# Altium schematic sheet XBEE_BREAKOUT.SchDoc: SPEXTRO - XBEE BREAKOUT
size A4; Author: Derek Belsky; Organization: RIT/SPEX; Address1: Rochester Institute of Technology; Address2: Rochester; Address3: New York; Address4: USA; Revision: 0; SheetNumber: 1; SheetTotal: 1
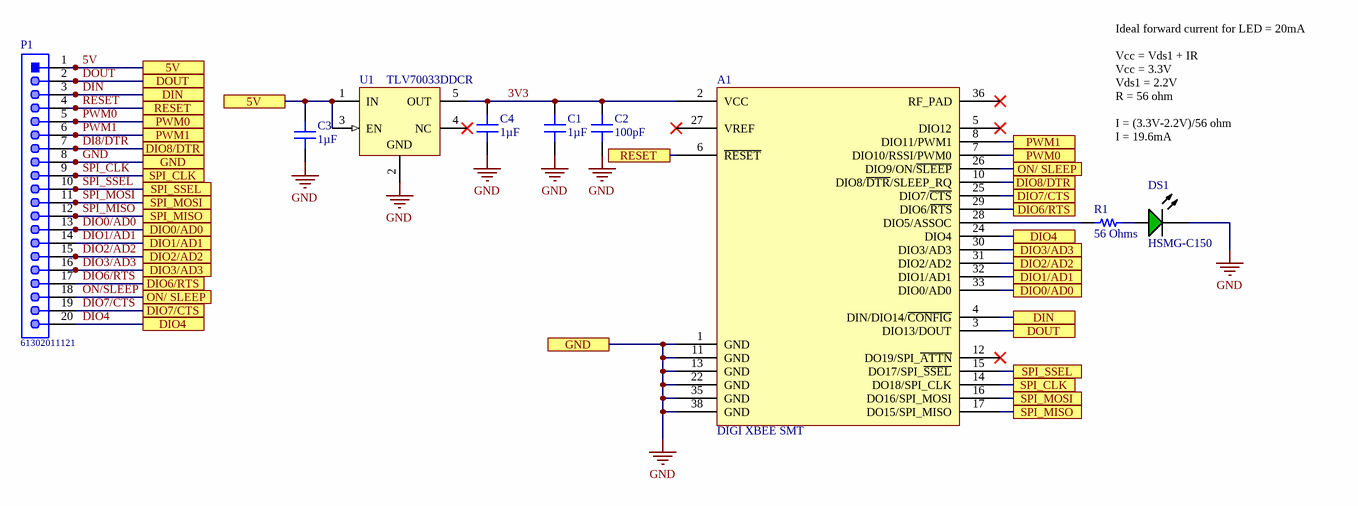
[diagram p0: XBEE_BREAKOUT.SchDoc]

## Parts
A1  DIGI XBEE SMT  [*XCVR_XBP9X-DMUS-001]
C1  1µF  [CAP 0603_1608]
C2  100pF  [CAP 0603_1608]
C3  1µF  [CAP 0603_1608]
C4  1µF  [CAP 0603_1608]
DS1  HSMG-C150  [AVAG-HSMX-C150_V]
P1  61302011121  [61302011121]
R1  56 Ohms  [RES 1206_3216]
U1  TLV70033DDCR  [DDC0005A_M]

## Ports
5V, DIN, DIO0/AD0, DIO1/AD1, DIO2/AD2, DIO3/AD3, DIO4, DIO6/RTS, DIO7/CTS, DIO8/DTR, DOUT, GND, ON/ SLEEP, PWM0, PWM1, RESET, SPI_CLK, SPI_MISO, SPI_MOSI, SPI_SSEL

## Nets
GND: A1.1(GND) A1.11(GND) A1.13(GND) A1.22(GND) A1.35(GND) A1.38(GND) C1.1 C2.1 C3.1 C4.1 DS1.2(K) P1.8 U1.2(GND) ; port GND
3V3: A1.2(VCC) C1.2 C2.2 C4.2 U1.5(OUT)
5V: C3.2 P1.1 U1.1(IN) U1.3(EN) ; port 5V
DI8/DTR: A1.10(DIO8/~{DTR}/SLEEP_RQ) P1.7 ; port DIO8/DTR
DIN: A1.4(DIN/DIO14/~{CONFIG}) P1.3 ; port DIN
DIO0/AD0: A1.33(DIO0/AD0) P1.13 ; port DIO0/AD0
DIO1/AD1: A1.32(DIO1/AD1) P1.14 ; port DIO1/AD1
DIO2/AD2: A1.31(DIO2/AD2) P1.15 ; port DIO2/AD2
DIO3/AD3: A1.30(DIO3/AD3) P1.16 ; port DIO3/AD3
DIO4: A1.24(DIO4) P1.20 ; port DIO4
DIO6/RTS: A1.29(DIO6/~{RTS}) P1.17 ; port DIO6/RTS
DIO7/CTS: A1.25(DIO7/~{CTS}) P1.19 ; port DIO7/CTS
DOUT: A1.3(DIO13/DOUT) P1.2 ; port DOUT
ON/SLEEP: A1.26(DIO9/ON/~{SLEEP}) P1.18 ; port ON/ SLEEP
PWM0: A1.7(DIO10/RSSI/PWM0) P1.5 ; port PWM0
PWM1: A1.8(DIO11/PWM1) P1.6 ; port PWM1
RESET: A1.6(~{RESET}) P1.4 ; port RESET
SPI_CLK: A1.14(DO18/SPI_CLK) P1.9 ; port SPI_CLK
SPI_MISO: A1.17(DO15/SPI_MISO) P1.12 ; port SPI_MISO
SPI_MOSI: A1.16(DO16/SPI_MOSI) P1.11 ; port SPI_MOSI
SPI_SSEL: A1.15(DO17/SPI_~{SSEL}) P1.10 ; port SPI_SSEL
NetA1_28: A1.28(DIO5/ASSOC) R1.1
NetDS1_1: DS1.1(A) R1.2

Not connected (* = marked no-connect by the designer): A1 5(DIO12)* 12(DO19/SPI_~{ATTN})* 27(VREF)* 36(RF_PAD)*; U1 4(NC)*

## Notes on the sheet
- Ideal forward current for LED = 20mA
  Vcc = Vds1 + IR
  Vcc = 3.3V
  Vds1 = 2.2V
  R = 56 ohm
  I = (3.3V-2.2V)/56 ohm
  I = 19.6mA
- Title
- Size:
- Date:
- A4
- Author
- Time:
- Sheet
- Revision:
- of
- RIT Space Exploration Team
- Rochester Institute of Technology
- 1 Lomb Memorial Drive
- Rochester, NY 14623
- https://spex.rit.edu
- File:

## Library data of the parts
C1 C3 C4 = CC0603KRX7R6BB105: CAP CER 1UF 10V X7R 0603; Manufacturer: Yageo; Tolerance: ±10%; Part Number: CC0603KRX7R6BB105; Value: 1µF; Applications: General Purpose; Capacitance: 1µF; ComponentLink1Description: Datasheet; ComponentLink1URL: https://www.yageo.com/upload/media/product/productsearch/datasheet/mlcc/UPY-GPHC_X7R_6.3V-to-50V_18.pdf; ComponentLink2Description: DigiKey Link; ComponentLink2URL: http://digikey.com/product-detail/en/yageo/CC0603KRX7R6BB105/311-1796-1-ND/5195698; Device Package: 0603 (1608 Metric); LastUpdated: 1/21/2020 12:02:09 AM; Lifecycle Status: Active; Minimum Order: 1; Mounting Type: Surface Mount, MLCC; Operating Temperature: -55°C ~ 125°C; Package / Case: 0603 (1608 Metric); Packaging: TapeAndReel; PartId: 2290; Part Status: Active; Price: 0.02; Series: CC; Size / Dimension: 0.063" L x 0.031" W (1.60mm x 0.80mm); Supplier 1: DigiKey; Supplier Part Number 1: 311-1796-1-ND; Temperature Coefficient: X7R; Thickness (Max): 0.035" (0.90mm); Voltage - Rated: 10V
C2 = 06031A101FAT2A: CAP CER 100PF 100V C0G/NP0 0603; Manufacturer: AVX Corporation; Temperature Coefficient: C0G, NP0; Tolerance: ±1%; Part Number: 06031A101FAT2A; Value: 100pF; Applications: General Purpose; Capacitance: 100pF; ComponentLink1Description: Datasheet; ComponentLink1URL: http://datasheets.avx.com/C0GNP0-Dielectric.pdf; ComponentLink2Description: DigiKey Link; ComponentLink2URL: http://digikey.com/product-detail/en/avx-corporation/06031A101FAT2A/478-3671-1-ND/1116369; Device Package: 0603 (1608 Metric); LastUpdated: 1/21/2020 12:02:09 AM; Lifecycle Status: Active; Minimum Order: 1; Mounting Type: Surface Mount, MLCC; Operating Temperature: -55°C ~ 125°C; Package / Case: 0603 (1608 Metric); Packaging: TapeAndReel; PartId: 2633; Part Status: Active; Price: 0.10; Series: -; Size / Dimension: 0.063" L x 0.032" W (1.60mm x 0.81mm); Supplier 1: DigiKey; Supplier Part Number 1: 478-3671-1-ND; Thickness (Max): 0.035" (0.90mm); Voltage - Rated: 100V
DS1 = CMP-2000-05061-1: Chip LED, Green, 65 mW, 25 mA, -40 to 85 degC, 2-Pin SMD, RoHS, Tape and Reel; Manufacturer: Avago; Forward Voltage VF Max: 2.6V; Forward Current If Max: 20mA; Bulb Size: 1.6mmx2mm; PIV Max: 5V; Dominant Wavelength: 572nm; External Length / Height: 3.2mm; SVHC: NoSVHC(16-Jun-2014); Viewing Angle: 170deg; Peak Wavelength: 570nm; External Width: 1.6mm; No. of Pins: 2; Luminous Intensity Typ: 15mcd; Light Output Orientation: TopEmitting; LED Type: Standard; Luminous Intensity @ If Min: 4.5mcd; Voltage Vf Min: 2.2V; Lens Shape: Rectangular; External Depth: 1.1mm; Material: GaP; Opto Mounting Orientation: Top; Package Reference: HSMX-C150; Mounting Type: SMD; Datasheet Version: Mar-12; Storage Temperature Max: 85degC; Forward Current If: 20mA; Operating Temperature Min: -30degC; Operating Temperature Max: 85degC; Wavelength Typ: 572nm; Datasheet URL: https://datasheet.ciiva.com/11774/0900766b804a6539-11774272.pdf; Luminous Intensity: 15mcd; Manufacturer URL: http://www.avagotech.com/; Storage Temperature Min: -40degC; Package Description: 2-Pin Surface Mount Device, Body 3.2 x 1.6 mm; MSL: MSL2A-4weeks; LED Colour: Green; Operating Temperature Range: -30degCto+85degC; LED Mounting: SMD; Voltage Vf Typ: 2.2V; Opto Case Style: SMD; Packaging: CutTape; Forward Voltage: 2.2V; Reverse Protection Voltage: 5V
P1 = CMP-1502-01102-1: THT Vertical Pin Header WR-PHD, Pitch 2.54 mm, Single Row, 20 pins; Manufacturer: Wurth Elektronik; Withstanding Voltage: 500VAC; Gender: Male; Pin Number: 20; Rated Current: 3A; Contact Resistance: 20mOhm; Pitch: 2.54mm; Working Voltage: 250VAC; Publisher: WurthElektronik; Packaging: Bag; Datasheet URL: https://katalog.we-online.de/em/datasheet/6130xx11121.pdf; Row Number: Single; Mounting Technology: THT; Manufacturer URL: http://www.we-online.de; Orientation: Vertical; Package Reference: 61302011121; Part Number: 61302011121; Operating Temperature: -40to105degC
R1 = CR1206-FX-56R0ELF: RES SMD 56 OHM 1% 1/4W 1206; Manufacturer: Bourns Inc.; Power (Watts): 0.25W, 1/4W; Temperature Coefficient: ±100ppm/°C; Part Number: CR1206-FX-56R0ELF; ComponentLink1Description: Datasheet; ComponentLink1URL: https://www.bourns.com/docs/Product-Datasheets/CHPREZTR.pdf; ComponentLink2Description: DigiKey Link; ComponentLink2URL: http://digikey.com/product-detail/en/bourns-inc/CR1206-FX-56R0ELF/CR1206-FX-56R0ELFCT-ND/3767738; Composition: Thick Film; Device Package: 1206 (3216 Metric); Features: Moisture Resistant; Height - Seated (Max): 0.030" (0.75mm); LastUpdated: 1/21/2020 1:08:34 AM; Lifecycle Status: Active; Minimum Order: 1; Number of Terminations: 2; Operating Temperature: -55°C ~ 155°C; Package / Case: 1206 (3216 Metric); Packaging: TapeAndReel; PartId: 26887; Part Status: Active; Price: 0.01; Resistance: 56 Ohms; Series: CR1206; Size / Dimension: 0.126" L x 0.063" W (3.20mm x 1.60mm); Supplier 1: DigiKey; Supplier Part Number 1: CR1206-FX-56R0ELFCT-ND; Supplier Device Package: 1206; Tolerance: ±1%; Value: 56 Ohms
U1 = CMP-0394-01056-2: Single Output LDO, 200 mA, Fixed 3.3 V Output, 2 to 5.5 V Input, with Low IQ, 5-pin SOT (DDC), -40 to 125 degC, Green (RoHS & no Sb/Br); Manufacturer: Texas Instruments; Vin(Min)(V): 2; Vout Adj(Max)(V): 3.3; Iq(Typ)(mA): 0.03; SubFamily: Single Channel LDO; Iout(Max)(A): 0.2; Vdo(Typ)(mV): 175; Vin(Max)(V): 5.5; DatasheetVersion: SLVSA00D; Mounting Technology: Surface Mount; Accuracy(%): 2; ComponentLink1URL: http://www.ti.com/; ComponentLink2URL: http://www.ti.com/general/docs/lit/getliterature.tsp?genericPartNumber=TLV70033&fileType=pdf; ComponentLink3URL: http://www.ti.com/litv/pdf/mpds123d; PackageDescription: 5-Pin Plastic Small Outline, Body 2.9 x 1.6 mm, 0.95 mm Pitch; Vout Adj(Min)(V): 3.3; PackageVersion: 4204403-2/E; PartNumber: TLV70033DDCR; ComponentLink1Description: Manufacturer URL; PackageReference: DDC0005A; Code_JEDEC: MO-193; Fixed Output Options(V): 3.3; Eco-Plan: Green (RoHS & no Sb/Br); ComponentLink2Description: Datasheet; ComponentLink3Description: Package Specification